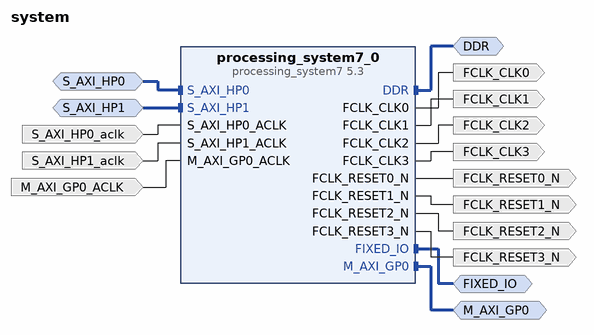
[diagram p0: block diagram of the top level]
# Vivado block design system, Vivado 2013.3
create_bd_design system

create_bd_intf_port -mode Master -vlnv xilinx.com:interface:ddrx_rtl:1.0 DDR
create_bd_intf_port -mode Master -vlnv xilinx.com:display_processing_system7:fixedio_rtl:1.0 FIXED_IO
create_bd_intf_port -mode Master -vlnv xilinx.com:interface:aximm_rtl:1.0 M_AXI_GP0
set_property -dict [list \
  CONFIG.DATA_WIDTH 32 \
  CONFIG.PROTOCOL AXI3 \
  CONFIG.FREQ_HZ 125000000 \
  CONFIG.ADDR_WIDTH 32 \
] [get_bd_intf_ports M_AXI_GP0]
create_bd_intf_port -mode Slave -vlnv xilinx.com:interface:aximm_rtl:1.0 S_AXI_HP0
set_property -dict [list \
  CONFIG.DATA_WIDTH 64 \
  CONFIG.PROTOCOL AXI3 \
  CONFIG.FREQ_HZ 125000000 \
  CONFIG.ID_WIDTH 0 \
  CONFIG.ADDR_WIDTH 32 \
  CONFIG.AWUSER_WIDTH 0 \
  CONFIG.ARUSER_WIDTH 0 \
  CONFIG.WUSER_WIDTH 0 \
  CONFIG.RUSER_WIDTH 0 \
  CONFIG.BUSER_WIDTH 0 \
  CONFIG.READ_WRITE_MODE READ_WRITE \
  CONFIG.SUPPORTS_NARROW_BURST 1 \
  CONFIG.NUM_READ_OUTSTANDING 1 \
  CONFIG.NUM_WRITE_OUTSTANDING 1 \
  CONFIG.MAX_BURST_LENGTH 256 \
  CONFIG.PHASE 0.000 \
] [get_bd_intf_ports S_AXI_HP0]
create_bd_intf_port -mode Slave -vlnv xilinx.com:interface:aximm_rtl:1.0 S_AXI_HP1
set_property -dict [list \
  CONFIG.DATA_WIDTH 64 \
  CONFIG.PROTOCOL AXI3 \
  CONFIG.FREQ_HZ 125000000 \
  CONFIG.ID_WIDTH 0 \
  CONFIG.ADDR_WIDTH 32 \
  CONFIG.AWUSER_WIDTH 0 \
  CONFIG.ARUSER_WIDTH 0 \
  CONFIG.WUSER_WIDTH 0 \
  CONFIG.RUSER_WIDTH 0 \
  CONFIG.BUSER_WIDTH 0 \
  CONFIG.READ_WRITE_MODE READ_WRITE \
  CONFIG.SUPPORTS_NARROW_BURST 1 \
  CONFIG.NUM_READ_OUTSTANDING 1 \
  CONFIG.NUM_WRITE_OUTSTANDING 1 \
  CONFIG.MAX_BURST_LENGTH 256 \
  CONFIG.PHASE 0.000 \
] [get_bd_intf_ports S_AXI_HP1]
create_bd_port -dir O -type clk FCLK_CLK1
create_bd_port -dir O -type clk FCLK_CLK2
create_bd_port -dir O -type clk FCLK_CLK3
create_bd_port -dir O -type rst FCLK_RESET0_N
create_bd_port -dir O -type rst FCLK_RESET1_N
create_bd_port -dir O -type rst FCLK_RESET2_N
create_bd_port -dir O -type rst FCLK_RESET3_N
create_bd_port -dir I -type clk S_AXI_HP0_aclk
set_property -dict {CONFIG.FREQ_HZ 125000000} [get_bd_ports S_AXI_HP0_aclk]
create_bd_port -dir I -type clk S_AXI_HP1_aclk
set_property -dict {CONFIG.FREQ_HZ 125000000} [get_bd_ports S_AXI_HP1_aclk]
create_bd_port -dir I -type clk M_AXI_GP0_ACLK
set_property -dict {CONFIG.FREQ_HZ 125000000 CONFIG.ASSOCIATED_BUSIF M_AXI_GP0} [get_bd_ports M_AXI_GP0_ACLK]
create_bd_port -dir O -type clk FCLK_CLK0

create_bd_cell -type ip -vlnv xilinx.com:ip:processing_system7:5.3 processing_system7_0
set_property -dict [list \
  CONFIG.PCW_QSPI_PERIPHERAL_FREQMHZ 125 \
  CONFIG.PCW_FPGA0_PERIPHERAL_FREQMHZ 125 \
  CONFIG.PCW_FPGA1_PERIPHERAL_FREQMHZ 250 \
  CONFIG.PCW_FPGA3_PERIPHERAL_FREQMHZ 200 \
  CONFIG.PCW_USE_S_AXI_HP0 1 \
  CONFIG.PCW_USE_S_AXI_HP1 1 \
  CONFIG.PCW_EN_CLK1_PORT 1 \
  CONFIG.PCW_EN_CLK2_PORT 1 \
  CONFIG.PCW_EN_CLK3_PORT 1 \
  CONFIG.PCW_EN_RST1_PORT 1 \
  CONFIG.PCW_EN_RST2_PORT 1 \
  CONFIG.PCW_EN_RST3_PORT 1 \
  CONFIG.PCW_PRESET_BANK1_VOLTAGE {LVCMOS 2.5V} \
  CONFIG.PCW_UIPARAM_DDR_BUS_WIDTH {16 Bit} \
  CONFIG.PCW_UIPARAM_DDR_PARTNO {MT41J256M16 RE-125} \
  CONFIG.PCW_QSPI_PERIPHERAL_ENABLE 1 \
  CONFIG.PCW_ENET0_PERIPHERAL_ENABLE 1 \
  CONFIG.PCW_ENET0_ENET0_IO {MIO 16 .. 27} \
  CONFIG.PCW_ENET0_GRP_MDIO_ENABLE 1 \
  CONFIG.PCW_SD0_PERIPHERAL_ENABLE 1 \
  CONFIG.PCW_SD0_GRP_CD_ENABLE 1 \
  CONFIG.PCW_SD0_GRP_CD_IO {MIO 46} \
  CONFIG.PCW_SD0_GRP_WP_ENABLE 1 \
  CONFIG.PCW_SD0_GRP_WP_IO {MIO 47} \
  CONFIG.PCW_UART0_PERIPHERAL_ENABLE 1 \
  CONFIG.PCW_UART0_UART0_IO {MIO 14 .. 15} \
  CONFIG.PCW_UART1_PERIPHERAL_ENABLE 1 \
  CONFIG.PCW_UART1_UART1_IO {MIO 8 .. 9} \
  CONFIG.PCW_SPI1_PERIPHERAL_ENABLE 1 \
  CONFIG.PCW_SPI1_SPI1_IO {MIO 10 .. 15} \
  CONFIG.PCW_TTC0_PERIPHERAL_ENABLE 1 \
  CONFIG.PCW_USB0_PERIPHERAL_ENABLE 1 \
  CONFIG.PCW_USB0_RESET_ENABLE 1 \
  CONFIG.PCW_USB0_RESET_IO {MIO 48} \
  CONFIG.PCW_I2C0_PERIPHERAL_ENABLE 1 \
  CONFIG.PCW_I2C0_I2C0_IO {MIO 50 .. 51} \
  CONFIG.PCW_GPIO_MIO_GPIO_ENABLE 1 \
] [get_bd_cells processing_system7_0]
# 49 more settings of processing_system7_0 are not shown: defaults, MIO pin electricals, DDR timing, and values the tool derives

# ---- connections ----

connect_bd_intf_net [get_bd_intf_ports DDR] [get_bd_intf_pins processing_system7_0/DDR]
connect_bd_intf_net [get_bd_intf_ports FIXED_IO] [get_bd_intf_pins processing_system7_0/FIXED_IO]
connect_bd_intf_net [get_bd_intf_ports M_AXI_GP0] [get_bd_intf_pins processing_system7_0/M_AXI_GP0]
connect_bd_intf_net -intf_net s_axi_hp0_1 [get_bd_intf_ports S_AXI_HP0] [get_bd_intf_pins processing_system7_0/S_AXI_HP0]
connect_bd_intf_net -intf_net s_axi_hp1_1 [get_bd_intf_ports S_AXI_HP1] [get_bd_intf_pins processing_system7_0/S_AXI_HP1]
connect_bd_net [get_bd_pins processing_system7_0/FCLK_CLK1] [get_bd_ports FCLK_CLK1]
connect_bd_net [get_bd_pins processing_system7_0/FCLK_CLK2] [get_bd_ports FCLK_CLK2]
connect_bd_net [get_bd_pins processing_system7_0/FCLK_CLK3] [get_bd_ports FCLK_CLK3]
connect_bd_net [get_bd_pins processing_system7_0/FCLK_RESET0_N] [get_bd_ports FCLK_RESET0_N]
connect_bd_net [get_bd_pins processing_system7_0/FCLK_RESET1_N] [get_bd_ports FCLK_RESET1_N]
connect_bd_net [get_bd_pins processing_system7_0/FCLK_RESET2_N] [get_bd_ports FCLK_RESET2_N]
connect_bd_net [get_bd_pins processing_system7_0/FCLK_RESET3_N] [get_bd_ports FCLK_RESET3_N]
connect_bd_net [get_bd_ports S_AXI_HP0_aclk] [get_bd_pins processing_system7_0/S_AXI_HP0_ACLK]
connect_bd_net [get_bd_ports S_AXI_HP1_aclk] [get_bd_pins processing_system7_0/S_AXI_HP1_ACLK]
connect_bd_net [get_bd_ports M_AXI_GP0_ACLK] [get_bd_pins processing_system7_0/M_AXI_GP0_ACLK]
connect_bd_net [get_bd_pins processing_system7_0/FCLK_CLK0] [get_bd_ports FCLK_CLK0]

# ---- address map ----
assign_bd_address -offset 0x40000000 -range 1G -target_address_space [get_bd_addr_spaces processing_system7_0/Data] [get_bd_addr_segs M_AXI_GP0/Reg]
assign_bd_address -offset 0x00000000 -range 512M -target_address_space [get_bd_addr_spaces S_AXI_HP0] [get_bd_addr_segs processing_system7_0/S_AXI_HP0/HP0_DDR_LOWOCM]
assign_bd_address -offset 0x00000000 -range 512M -target_address_space [get_bd_addr_spaces S_AXI_HP1] [get_bd_addr_segs processing_system7_0/S_AXI_HP1/HP1_DDR_LOWOCM]

validate_bd_design
save_bd_design
